# Altium schematic sheet TS3USB3031_2-ch_2p3t_Multiplexer.SchDoc: TS3USB3031 2-ch 2p3t Multiplexer
size A4
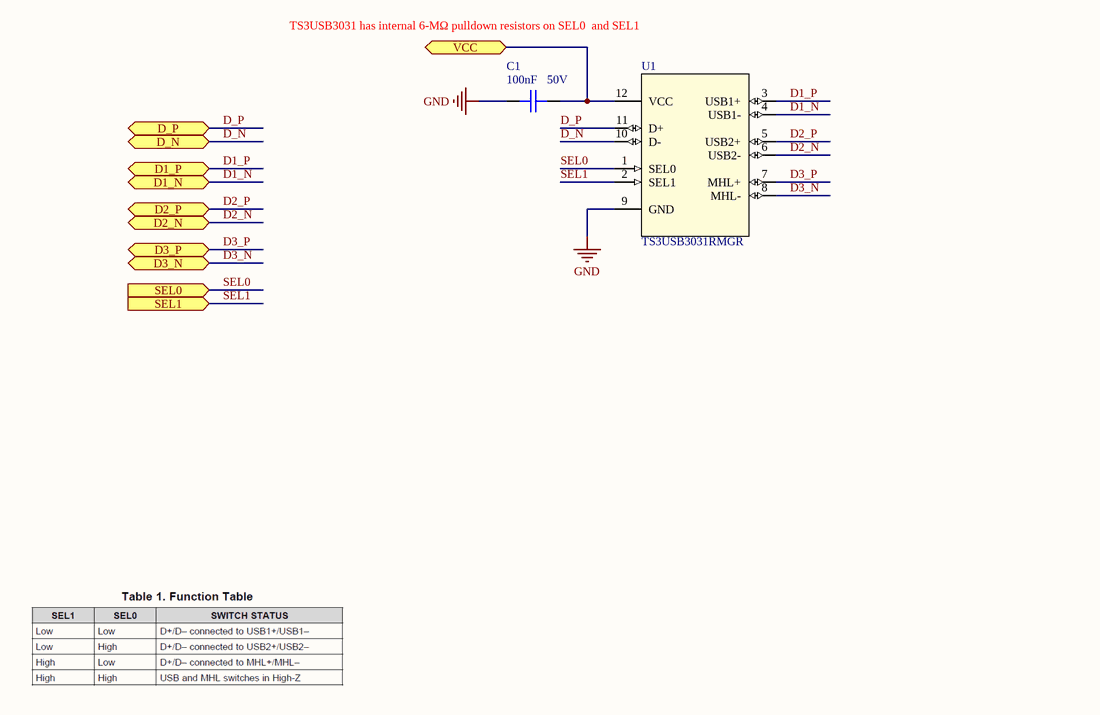
[diagram p0: TS3USB3031_2-ch_2p3t_Multiplexer.SchDoc]

## Parts
C1  Capacitance: 100nF  Voltage: 50V  [C0402]  (hidden comment: CAP CER 0.1UF 50V X7R 0402)
U1  TS3USB3031RMGR  [RMG12_TEX]

## Ports
D1_N (bidir), D1_P (bidir), D2_N (bidir), D2_P (bidir), D3_N (bidir), D3_P (bidir), D_N (bidir), D_P (bidir), SEL0 (in), SEL1 (in), VCC

## Nets
GND: C1.1 U1.9(GND)
D1_N: U1.4(USB1-) ; port D1_N
D1_P: U1.3(USB1+) ; port D1_P
D2_N: U1.6(USB2-) ; port D2_N
D2_P: U1.5(USB2+) ; port D2_P
D3_N: U1.8(MHL-) ; port D3_N
D3_P: U1.7(MHL+) ; port D3_P
D_N: U1.10(D-) ; port D_N
D_P: U1.11(D+) ; port D_P
SEL0: U1.1(SEL0) ; port SEL0
SEL1: U1.2(SEL1) ; port SEL1
VCC: C1.2 U1.12(VCC) ; port VCC

## Notes on the sheet
- TS3USB3031 has internal 6-MΩ pulldown resistors on SEL0  and SEL1
- Title
- Size:
- Date:
- A4
- Number:
- Time:
- Revision:
- Sheet
- of
- File:

## Library data of the parts
C1 = CAP CER 0.1UF 50V X7R 0402: 0.1µF ±10% 50V Ceramic Capacitor X7R 0402 (1005 Metric); Manufacturer: TDK; Manufacturer Part Number: CGA2B3X7R1H104K050BB; Supplier 1: Digi-Key; Stock 1: 2925303; Pricing 1: 1=0.17, 10=0.118, 50=0.0668, 100=0.0553, 500=0.0388, 1000=0.0321, 2500=0.0299, 5000=0.0273 (USD); Mount: Surface Mount; Case/Package: 0402; Weight: 2.3E-05oz; Case Code (Metric): 1005; Case Code (Imperial): 0402; Min Operating Temperature: -55°C; Max Operating Temperature: 125°C; Voltage Rating: 50V; Tolerance: 10%; Packaging: Tape and Reel; Package Quantity: 1; Voltage Rating (DC): 50V; Dielectric: X7R; Termination: SMD/SMT; Composition: Ceramic; Length: 1mm; Height: 0.5mm; Width: 0.02inch; Thickness: 0.022inch; Depth: 0.5mm; Ratings: AEC-Q200; REACH SVHC: No SVHC; Lead Free: Lead Free; ComponentLink1URL: http://product.tdk.com/capacitor/mlcc/en/documents/mlccspec_automotive_general_midvoltage_en.pdf?src-supplier=Future+Electronics; ComponentLink1Description: http://product.tdk.com/capacitor/mlcc/en/documents/mlccspec_automotive_general_midvoltage_en.pdf?src-supplier=Future+Electronics; ComponentLink2URL: http://www.farnell.com/datasheets/1807242.pdf?src-supplier=Element14; ComponentLink2Description: http://www.farnell.com/datasheets/1807242.pdf?src-supplier=Element14; ComponentLink3URL: http://www.mouser.com/ds/2/400/lcc_automotive_general_en-843974.pdf?src-supplier=Mouser; ComponentLink3Description: http://www.mouser.com/ds/2/400/lcc_automotive_general_en-843974.pdf?src-supplier=Mouser; ComponentLink4URL: http://www.farnell.com/datasheets/1936565.pdf?src-supplier=Element14; ComponentLink4Description: http://www.farnell.com/datasheets/1936565.pdf?src-supplier=Element14; ComponentLink5URL: http://www.farnell.com/datasheets/1735392.pdf?src-supplier=Element14; ComponentLink5Description: http://www.farnell.com/datasheets/1735392.pdf?src-supplier=Element14; Supplier Part Number 1: 445-6899-1-ND
U1 = IC TS3USB3031 USB SWITCH DUAL 1X2 12WQFN: USB Switch IC 1 Channel 12-WQFN (1.8x1.8); Manufacturer: Texas Instruments; Bandwidth: 6.5 GHz; Configuration: 1 x DP3T; Off Time - Max: 0.1 ns; On Resistance - Max: 7 Ohms; On Time - Max: 100 us; Development Kit: TS3USB3031EVM; Number of Switches: 2 Switch; Operating Supply Current: 40 uA; Operating Supply Voltage: 2.5 V; Supply Voltage - Max: 4.3 V; Switch Continuous Current: 60 mA; Supplier 1: Mouser; Manufacturer Part Number: TS3USB3031RMGR; RoHS: RoHS Compliant; Category: USB Switch ICs; Stock 1: 14547; Pricing 1: 1=1.16, 10=0.980, 100=0.753, 250=0.666, 500=0.630, 1000=0.490, 3000=0.466, 6000=0.448, 9000=0.434 (USD); Package / Case: WQFN-12; Packaging: Cut Tape; Product: USB 2.0, MHL, MyDP Switches; Series: TS3USB3031; Brand: Texas Instruments; Mounting Style: SMD/SMT; Maximum Operating Temperature: + 85 C; Minimum Operating Temperature: - 40 C; Product Type: USB Switch ICs; Standard Pack Qty: 3000; Subcategory: Switch ICs; Supply Voltage - Min: 2.5 V; RoHS - Mouser: Y; Minimum Order Quantity: 1; Reeling: True; ComponentLink1URL: https://www.ti.com/lit/gpn/ts3usb3031; ComponentLink1Description: Data sheet; Supplier 2: Digi-Key; Supplier Part Number 1: 595-TS3USB3031RMGR; Supplier Part Number 2: 296-41018-1-ND; Mount: Surface Mount